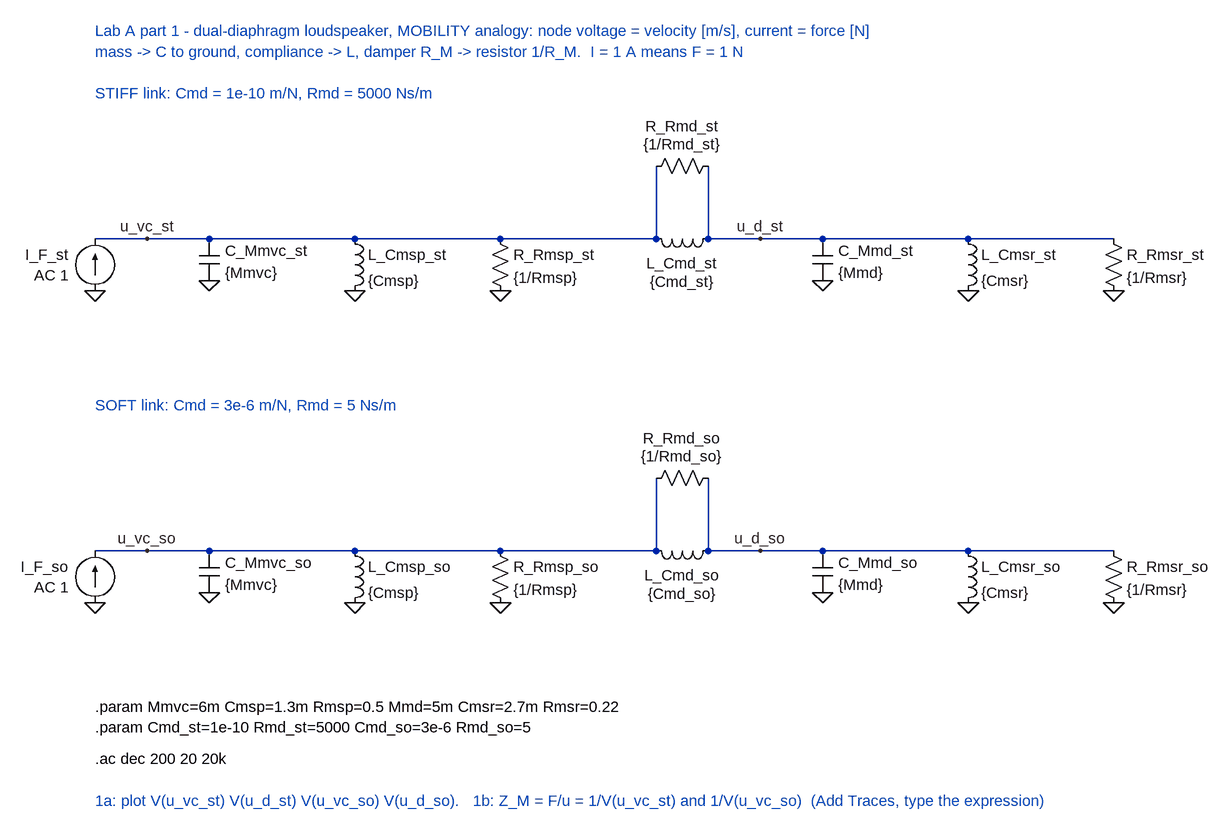
[diagram p0: schematic Part1_DualDiaphragm.asc]
Part1_DualDiaphragm.asc, the LTspice schematic file:
Version 4
SHEET 1 3000 1600
WIRE 0 0 864 0
WIRE 864 0 864 -112
WIRE 944 0 944 -112
WIRE 944 0 1568 0
WIRE 0 480 864 480
WIRE 864 480 864 368
WIRE 944 480 944 368
WIRE 944 480 1568 480
FLAG 0 80 0
FLAG 80 0 u_vc_st
FLAG 176 64 0
FLAG 400 80 0
FLAG 624 80 0
FLAG 1024 0 u_d_st
FLAG 1120 64 0
FLAG 1344 80 0
FLAG 1568 80 0
FLAG 0 560 0
FLAG 80 480 u_vc_so
FLAG 176 544 0
FLAG 400 560 0
FLAG 624 560 0
FLAG 1024 480 u_d_so
FLAG 1120 544 0
FLAG 1344 560 0
FLAG 1568 560 0
SYMBOL current 0 80 R180
WINDOW 0 40 56 Left 2
WINDOW 3 40 24 Left 2
SYMATTR InstName I_F_st
SYMATTR Value AC 1
SYMBOL cap 160 0 R0
WINDOW 0 40 18 Left 2
WINDOW 3 40 52 Left 2
SYMATTR InstName C_Mmvc_st
SYMATTR Value {Mmvc}
SYMBOL ind 384 -16 R0
SYMATTR InstName L_Cmsp_st
SYMATTR Value {Cmsp}
SYMATTR SpiceLine Rser=0
SYMBOL res 608 -16 R0
SYMATTR InstName R_Rmsp_st
SYMATTR Value {1/Rmsp}
SYMBOL ind 960 -16 R90
WINDOW 0 38 56 VTop 2
WINDOW 3 66 56 VTop 2
SYMATTR InstName L_Cmd_st
SYMATTR Value {Cmd_st}
SYMATTR SpiceLine Rser=1u
SYMBOL res 960 -128 R90
WINDOW 0 -30 56 VBottom 2
WINDOW 3 -2 56 VBottom 2
SYMATTR InstName R_Rmd_st
SYMATTR Value {1/Rmd_st}
SYMBOL cap 1104 0 R0
WINDOW 0 40 18 Left 2
WINDOW 3 40 52 Left 2
SYMATTR InstName C_Mmd_st
SYMATTR Value {Mmd}
SYMBOL ind 1328 -16 R0
SYMATTR InstName L_Cmsr_st
SYMATTR Value {Cmsr}
SYMATTR SpiceLine Rser=0
SYMBOL res 1552 -16 R0
SYMATTR InstName R_Rmsr_st
SYMATTR Value {1/Rmsr}
SYMBOL current 0 560 R180
WINDOW 0 40 56 Left 2
WINDOW 3 40 24 Left 2
SYMATTR InstName I_F_so
SYMATTR Value AC 1
SYMBOL cap 160 480 R0
WINDOW 0 40 18 Left 2
WINDOW 3 40 52 Left 2
SYMATTR InstName C_Mmvc_so
SYMATTR Value {Mmvc}
SYMBOL ind 384 464 R0
SYMATTR InstName L_Cmsp_so
SYMATTR Value {Cmsp}
SYMATTR SpiceLine Rser=0
SYMBOL res 608 464 R0
SYMATTR InstName R_Rmsp_so
SYMATTR Value {1/Rmsp}
SYMBOL ind 960 464 R90
WINDOW 0 38 56 VTop 2
WINDOW 3 66 56 VTop 2
SYMATTR InstName L_Cmd_so
SYMATTR Value {Cmd_so}
SYMATTR SpiceLine Rser=1u
SYMBOL res 960 352 R90
WINDOW 0 -30 56 VBottom 2
WINDOW 3 -2 56 VBottom 2
SYMATTR InstName R_Rmd_so
SYMATTR Value {1/Rmd_so}
SYMBOL cap 1104 480 R0
WINDOW 0 40 18 Left 2
WINDOW 3 40 52 Left 2
SYMATTR InstName C_Mmd_so
SYMATTR Value {Mmd}
SYMBOL ind 1328 464 R0
SYMATTR InstName L_Cmsr_so
SYMATTR Value {Cmsr}
SYMATTR SpiceLine Rser=0
SYMBOL res 1552 464 R0
SYMATTR InstName R_Rmsr_so
SYMATTR Value {1/Rmsr}
TEXT 0 -320 Left 2 ;Lab A part 1 - dual-diaphragm loudspeaker, MOBILITY analogy: node voltage = velocity [m/s], current = force [N]
TEXT 0 -288 Left 2 ;mass -> C to ground, compliance -> L, damper R_M -> resistor 1/R_M.  I = 1 A means F = 1 N
TEXT 0 -224 Left 2 ;STIFF link: Cmd = 1e-10 m/N, Rmd = 5000 Ns/m
TEXT 0 256 Left 2 ;SOFT link: Cmd = 3e-6 m/N, Rmd = 5 Ns/m
TEXT 0 720 Left 2 !.param Mmvc=6m Cmsp=1.3m Rmsp=0.5 Mmd=5m Cmsr=2.7m Rmsr=0.22\n.param Cmd_st=1e-10 Rmd_st=5000 Cmd_so=3e-6 Rmd_so=5
TEXT 0 800 Left 2 !.ac dec 200 20 20k
TEXT 0 864 Left 2 ;1a: plot V(u_vc_st) V(u_d_st) V(u_vc_so) V(u_d_so).   1b: Z_M = F/u = 1/V(u_vc_st) and 1/V(u_vc_so)  (Add Traces, type the expression)

The netlist it stands for:
* Part1_DualDiaphragm.asc
I_F_st 0 u_vc_st AC 1
C_Mmvc_st u_vc_st 0 {Mmvc}
L_Cmsp_st u_vc_st 0 {Cmsp} Rser=0
R_Rmsp_st u_vc_st 0 {1/Rmsp}
L_Cmd_st u_d_st u_vc_st {Cmd_st} Rser=1u
R_Rmd_st u_d_st u_vc_st {1/Rmd_st}
C_Mmd_st u_d_st 0 {Mmd}
L_Cmsr_st u_d_st 0 {Cmsr} Rser=0
R_Rmsr_st u_d_st 0 {1/Rmsr}
I_F_so 0 u_vc_so AC 1
C_Mmvc_so u_vc_so 0 {Mmvc}
L_Cmsp_so u_vc_so 0 {Cmsp} Rser=0
R_Rmsp_so u_vc_so 0 {1/Rmsp}
L_Cmd_so u_d_so u_vc_so {Cmd_so} Rser=1u
R_Rmd_so u_d_so u_vc_so {1/Rmd_so}
C_Mmd_so u_d_so 0 {Mmd}
L_Cmsr_so u_d_so 0 {Cmsr} Rser=0
R_Rmsr_so u_d_so 0 {1/Rmsr}
* Lab A part 1 - dual-diaphragm loudspeaker, MOBILITY analogy: node voltage = velocity [m/s], current = force [N]
* mass -> C to ground, compliance -> L, damper R_M -> resistor 1/R_M.  I = 1 A means F = 1 N
* STIFF link: Cmd = 1e-10 m/N, Rmd = 5000 Ns/m
* SOFT link: Cmd = 3e-6 m/N, Rmd = 5 Ns/m
.param Mmvc=6m Cmsp=1.3m Rmsp=0.5 Mmd=5m Cmsr=2.7m Rmsr=0.22
.param Cmd_st=1e-10 Rmd_st=5000 Cmd_so=3e-6 Rmd_so=5
.ac dec 200 20 20k
* 1a: plot V(u_vc_st) V(u_d_st) V(u_vc_so) V(u_d_so).   1b: Z_M = F/u = 1/V(u_vc_st) and 1/V(u_vc_so)  (Add Traces, type the expression)
.backanno
.end